# EAGLE design IR-Blue BT4 PCB (EAGLE 6.2)
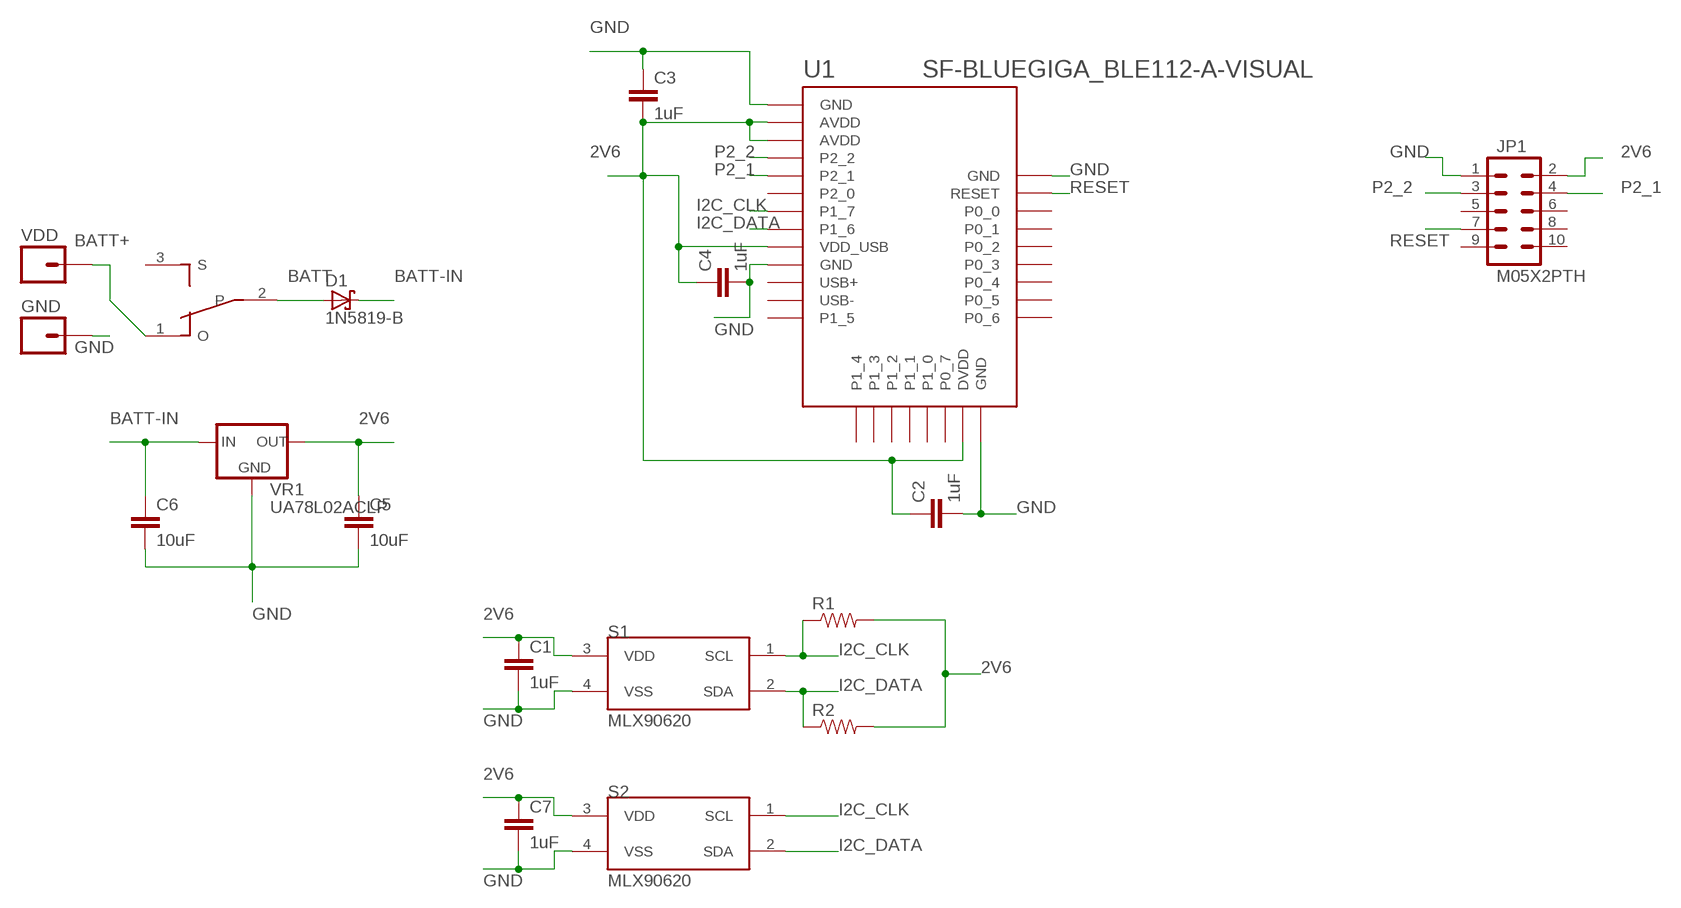
[diagram p0: schematic, sheet 1]

## Parts
C1  1uF  CAPPTH1  [CAP-PTH-5MM]
C2  1uF  CAPPTH1  [CAP-PTH-5MM]
C3  1uF  CAPPTH1  [CAP-PTH-5MM]
C4  1uF  CAPPTH1  [CAP-PTH-5MM]
C5  10uF  CAPPTH1  [CAP-PTH-5MM]
C6  10uF  CAPPTH1  [CAP-PTH-5MM]
C7  1uF  CAPPTH1  [CAP-PTH-5MM]
D1  1N5819-B  [DO41-7.6]
GND  M01PTH  [1X01]
JP1  M05X2PTH  [AVR_ICSP]
R1  RESISTORPTH-1/4W  [AXIAL-0.4]
R2  RESISTORPTH-1/4W  [AXIAL-0.4]
S1  MLX90620  [TO-39]
S2  MLX90620  [TO-39]
SW1  SMALL_SWITCH  [EG1213]
U1  SF-BLUEGIGA_BLE112-A-VISUAL  [SF-BLUEGIGA_BLE112-A]
VDD  M01PTH  [1X01]
VR1  UA78L02ACLP  2V6-VREG  [TO-92]

## Nets
2V6: C1.1 C2.1 C3.2 C4.1 C5.1 C7.1 JP1.2 R1.P$2 R2.P$2 S1.3(VDD) S2.3(VDD) U1.AVDD1(AVDD) U1.AVDD2(AVDD) U1.DVDD U1.VDD_USB VR1.1(OUT)
BATT: D1.A SW1.2(P)
BATT+: SW1.1(O) VDD.1
BATT-IN: C6.1 D1.C VR1.3(IN)
GND: C1.2 C2.2 C3.1 C4.2 C5.2 C6.2 C7.2 GND.1 JP1.1 S1.4(VSS) S2.4(VSS) U1.GND1(GND) U1.GND2(GND) U1.GND3(GND) U1.GND4(GND) VR1.2(GND)
I2C_CLK: R1.P$1 S1.1(SCL) S2.1(SCL) U1.P1_7
I2C_DATA: R2.P$1 S1.2(SDA) S2.2(SDA) U1.P1_6
P2_1: JP1.4 U1.P2_1
P2_2: JP1.3 U1.P2_2
RESET: JP1.7 U1.RESET
Unconnected: JP1.5 JP1.6 JP1.8 JP1.9 JP1.10 SW1.3(S) U1.P0_0 U1.P0_1 U1.P0_2 U1.P0_3 U1.P0_4 U1.P0_5 U1.P0_6 U1.P0_7 U1.P1_0 U1.P1_1 U1.P1_2 U1.P1_3 U1.P1_4 U1.P1_5 U1.P2_0 U1.USB+ U1.USB-

## Library data of the parts
C1-C7 = SparkFun-Boards:CAP: Capacitor Standard 0603 ceramic capacitor, and 0.1" leaded capacitor.
D1 = diode:1N581*: 1.0A SCHOTTKY BARRIER RECTIFIER Source: http://www.diodes.com/datasheets/ds23001.pdf
GND VDD = SparkFun-Connectors:M01: Header 1 Standard 1-pin 0.1" header. Use with straight break away headers (SKU : PRT-00116), right angle break away headers (PRT-00553), swiss pins (PRT-00743), machine pins (PRT-00117), and female headers (PRT-00115).
JP1 = SparkFun-Connectors:M05X2: Header 5x2 Standard 10-pin dual row 0.1" header. Commonly used with AVR-ISP. Use with Spark Fun Electronics SKU: PRT-00778
R1 R2 = SparkFun-LED:RESISTOR: Resistor Basic schematic elements and footprints for 0603, 1206, and PTH resistors.
S1 S2 = RHWorkshop:MLX90620: The MLX90620 is a fully calibrated 16x4 pixels IR array in an industry standard 4-lead TO-39 package. It contains 2 chips in one package: the Mlx90670 (IR array with signal conditioning electronics) and the 24AA02 (256x8 EEPROM) chip. The MlX90620 contains 64 IR pixels with dedicated low noise chopper stabilized amplifier and fast ADC integrated. A PTAT (Proportional To Absolute Temperature) sensor is integrated to measure the ambient temperature of the chip. The outputs of both IR and PTAT sensors are stored in internal RAM and are accessible through I2C.
SW1 = RHWorkshop:SMALL_SWITCH
U1 = RHWorkshop:SF-BLUEGIGA_BLE112-A-VISUAL: Bluetooth Low Energy single-mode module - Bluetooth 4.0, chip antenna
VR1 = RHWorkshop:2V6-VREG

## Net classes
0 default: width 0.406 mm, drill 0.305 mm, clearance 0.305 mm

## Board
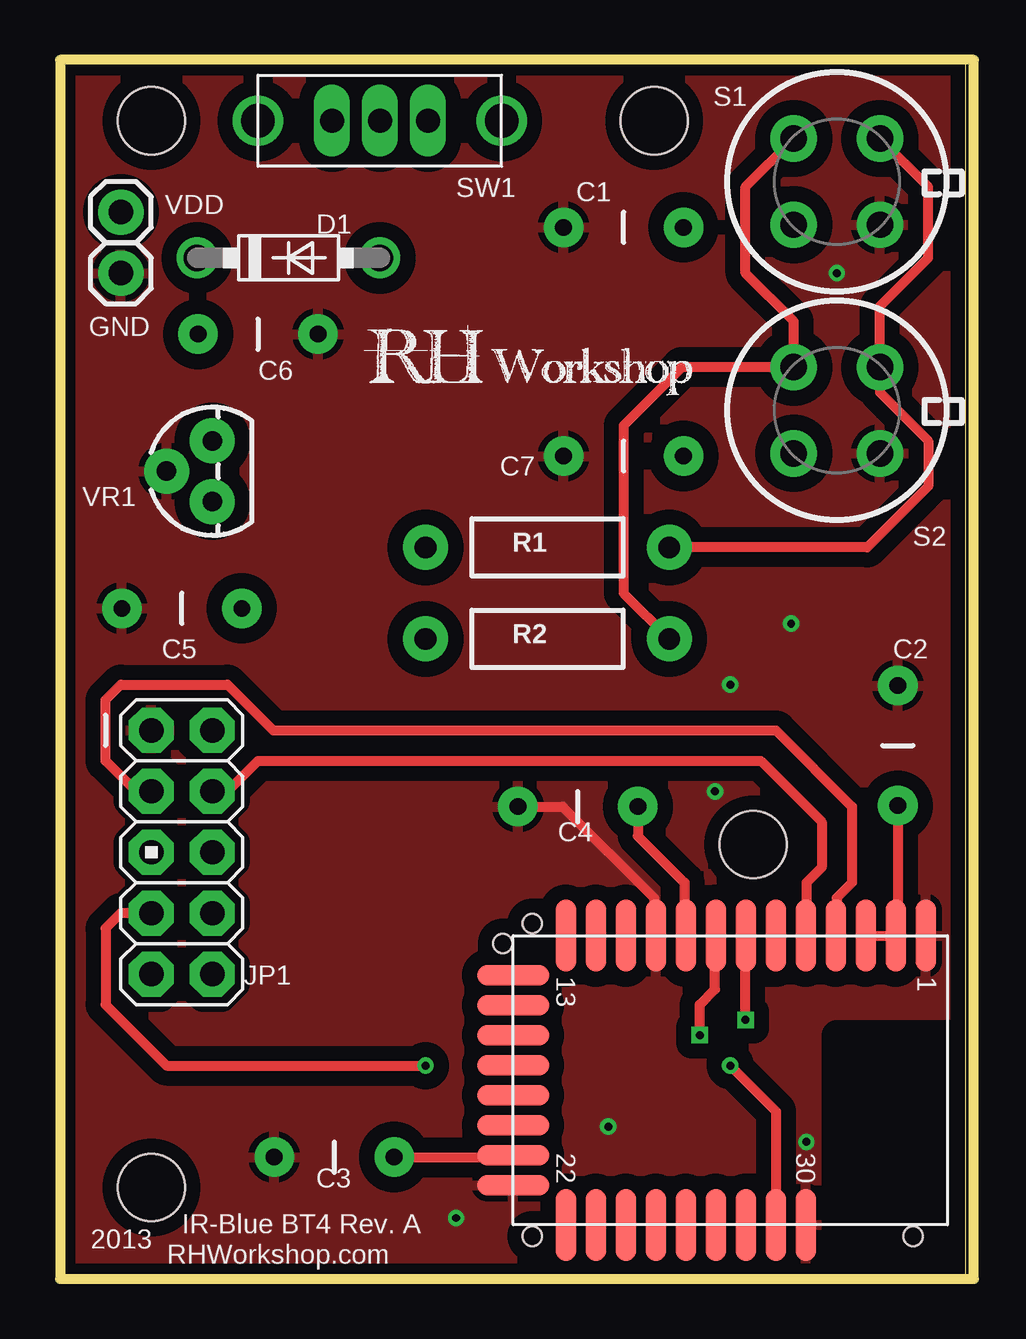
[diagram p1: board, top side]
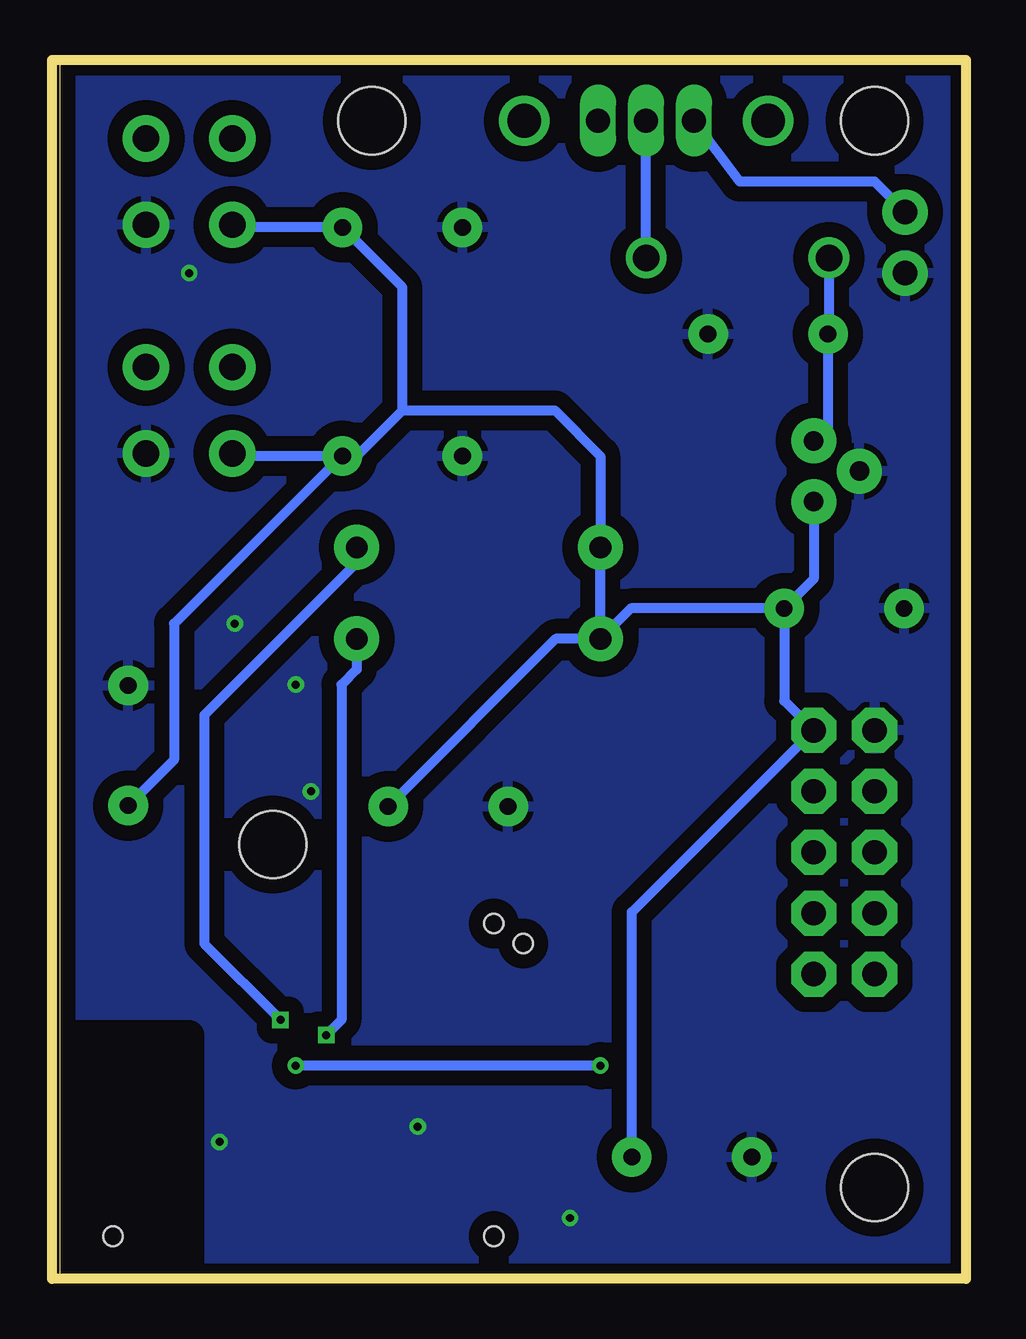
[diagram p2: board, bottom side, seen from below]

Size 37.77 x 50.79 mm. Coordinates in mm from the lower left corner, seen from the top.
Outline: 0,0 37.77,0 37.77,50.79 0,50.79 0,0
Copper layers (1*16): Top 0.0356mm / dielectric 1.5011mm / Bottom 0.0356mm
Design rules: minimum track width 6mil, minimum drill 13mil, track to track 6mil, track to pad 6mil, pad to pad 6mil, via to via 6mil, smd to smd 6mil, copper to edge 15mil, drill to drill 6mil, minimum pad ring 7mil, minimum via ring 7mil, stop-mask expansion 4mil, vias tented up to drill 13mil, thermal gap 10mil
Holes 2.8 mm at 3.81,3.81 28.89,18.1 3.81,48.26 24.77,48.26
Holes 0.8 mm at 35.56,1.78 19.68,1.78 19.68,14.81
Holes 0.79 mm at 18.47,13.97
tRestrict: area 32.4,0 to 38.1,10.2
bRestrict: area 32.4,0 to 38.1,10.2
Milling: 4 lines

### Footprints (pad centres in the part's own frame; a part is rotated, then mirrored left to right if it is on the bottom)
CAP-PTH-5MM = drill 0.7 pad 1.651: 1 -2.5,0; 2 2.5,0
DO41-7.6 = drill 1.1 pad 1.7: A 3.81,0; C -3.81,0
1X01 = drill 1.016 pad 1.88: 1 0,0
AVR_ICSP = drill 1.016 pad 1.88 octagon: 1 -1.27,5.08; 2 1.27,5.08; 3 -1.27,2.54; 4 1.27,2.54; 5 -1.27,0; 6 1.27,0; 7 -1.27,-2.54; 8 1.27,-2.54; 9 -1.27,-5.08; 10 1.27,-5.08
AXIAL-0.4 = drill 0.9 pad 1.88: P$1 -5.08,0; P$2 5.08,0
TO-39 = drill 1.1 pad 1.93: 1 2.54,0; 2 0,2.54; 3 -2.54,0; 4 0,-2.54
EG1213 = drill 1 long: 1 -1.999,0; 2 0,0; 3 1.999,0 | drill 1.4: P$1 -5.08,0; P$2 5.08,0
SF-BLUEGIGA_BLE112-A = smd 3 x 0.85: AVDD1 -6.05,6.9; AVDD2 -6.05,5.65; GND1 -6.05,8.15; GND2 -6.05,-3.1; GND4 6,3.15; P0_0 6,0.65; P0_1 6,-0.6; P0_2 6,-1.85; P0_3 6,-3.1; P0_4 6,-4.35; P0_5 6,-5.6; P0_6 6,-6.85; P1_5 -6.05,-6.85; P1_6 -6.05,-0.6; P1_7 -6.05,0.65; P2_0 -6.05,1.9; P2_1 -6.05,3.15; P2_2 -6.05,4.4; RESET 6,1.9; USB+ -6.05,-4.35; USB- -6.05,-5.6; VDD_USB -6.05,-1.85 | smd 0.85 x 3: DVDD 3.1,-9.05; GND3 4.35,-9.05; P0_7 1.85,-9.05; P1_0 0.6,-9.05; P1_1 -0.65,-9.05; P1_2 -1.9,-9.05; P1_3 -3.15,-9.05; P1_4 -4.4,-9.05
TO-92 = drill 0.813 pad 1.88: 1 -1.27,0; 2 0,1.905; 3 1.27,0

### Placement (x,y rotation side)
C1  23.5,43.81 180 top
C2  34.92,22.23 90 top
C3  11.43,5.08 0 top
C4  21.59,19.68 180 top
C5  5.08,27.94 180 top
C6  8.26,39.37 0 top
C7  23.5,34.29 180 top
D1  9.53,42.55 0 top
GND  2.54,41.91 0 top
JP1  5.08,17.78 0 top
R1  20.32,30.48 180 top
R2  20.32,26.67 180 top
S1  32.38,45.72 45 top
S2  32.38,36.2 45 top
SW1  13.34,48.26 0 top
U1  27.94,8.26 270 top
U$1  [RH-LOGO]  12.7,36.83 0 top
VDD  2.54,44.45 0 top
VR1  6.35,33.66 90 top

### Tracks (layer width: path | path; a pad name or v marks a point on that pad's centre or on a via)
2V6
  Top 0.406: U1.AVDD2 U1.AVDD1 34.92,14.39 C2.1 | C4.1 24.09,18.45 26.04,16.51 26.04,14.36 U1.VDD_USB | C3.2 18.82,5.08 U1.DVDD
  Bottom 0.406: R2.P$2 R1.P$2 15.24,34.29 17.14,36.2 23.5,36.2 | VR1.1 6.35,29.17 C5.1 | C5.1 7.58,24.09 JP1.2 13.93,15.28 C3.2 | C5.1 13.97,27.94 R2.P$2 | R2.P$2 17.11,26.67 C4.1 | 23.5,36.2 25.4,34.29 C7.1 26.04,34.29 | 23.5,36.2 23.5,41.31 C1.1 30.48,43.81 S1.3 | 26.04,34.29 33.02,27.3 33.02,21.63 C2.1 | 26.04,34.29 30.48,34.29 S2.3
BATT
  Bottom 0.406: D1.A SW1.2
BATT+
  Bottom 0.406: VDD.1 3.81,45.72 9.43,45.72 SW1.1
BATT-IN
  Bottom 0.406: D1.C 5.71,39.41 C6.1 5.75,35.52 VR1.3
GND  (via drill 0.33)
  Top 0.406: C4.2 20.95,19.68 24.77,15.88 24.77,14.38 U1.GND2
  other vias: 31.11,5.71 22.86,6.35 27.94,24.77 32.38,41.91 30.48,27.3 16.51,2.54 27.3,20.32
  pour Top (isolate 0.635, rank 6): 0,50.8 38.1,50.8 38.1,0 0,0
  pour Bottom (isolate 0.635, rank 6): 0,50.8 38.1,50.8 38.1,0 0,0
I2C_CLK  (via drill 0.33)
  Top 0.406: S1.1 36.2,45.5 36.2,42.55 34.18,40.53 S2.1 34.18,36.94 36.2,34.92 36.2,33.02 33.66,30.48 R1.P$1 | v28.57,10.79 28.57,14.29 U1.P1_7
  Bottom 0.406: R1.P$1 25.4,29.84 31.75,23.5 31.75,13.97 v28.57,10.79
I2C_DATA  (via drill 0.33)
  Top 0.406: S1.2 28.57,45.5 28.57,41.91 30.59,39.9 S2.2 25.93,37.99 23.5,35.56 23.5,28.57 R2.P$1 | v26.67,10.16 26.67,11.43 27.3,12.06 27.3,14.27 U1.P1_6
  Bottom 0.406: R2.P$1 25.4,25.4 26.04,24.77 26.04,10.79 v26.67,10.16
P2_1
  Top 0.406: JP1.4 6.99,20.32 8.26,21.59 29.21,21.59 31.75,19.05 31.75,17.14 31.11,16.51 31.11,14.33 U1.P2_1
P2_2
  Top 0.406: JP1.3 3.17,20.32 1.91,21.59 1.91,24.13 2.54,24.77 6.99,24.77 8.89,22.86 29.84,22.86 33.02,19.68 33.02,16.51 32.38,15.88 32.38,14.35 U1.P2_2
RESET  (via drill 0.33)
  Top 0.406: JP1.7 2.54,15.24 1.91,14.61 1.91,11.43 4.45,8.89 v15.24,8.89 | v27.94,8.89 29.84,6.99 29.84,2.9 U1.RESET
  Bottom 0.406: v15.24,8.89 v27.94,8.89

### Text on the board
tNames: SW1 | IR-Blue BT4 Rev. A | 2013 | RHWorkshop.com